# Altium schematic sheet Modulebit_004.SchDoc
size A2; Author: Steve Wiseman; Organization: Arbury.com Ltd; Address1: 2 Durnford Way; Address2: Cambridge; Address3: CB4 2DP; Address4: Unted Kingdom; DocumentNumber: 1; SheetNumber: 1; SheetTotal: 1
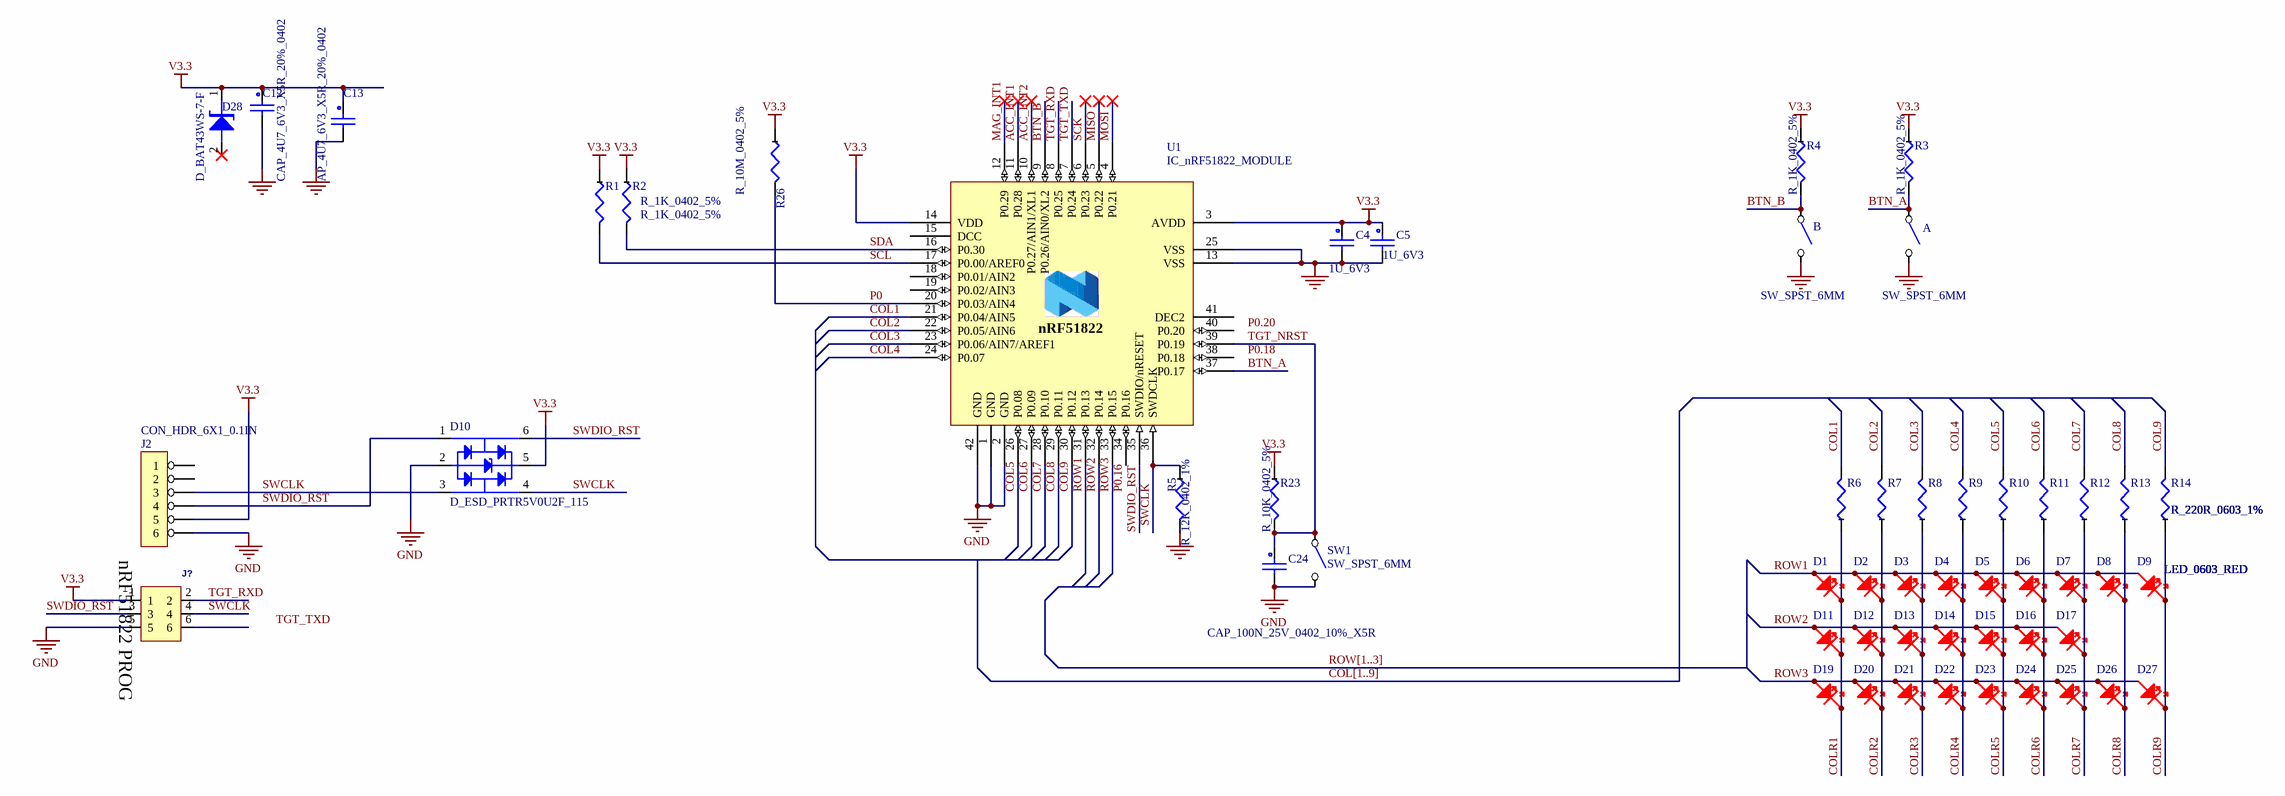
[diagram p0: Modulebit_004.SchDoc]

## Parts
A  SW_SPST_6MM  [SW_FSM4JSMA]
B  SW_SPST_6MM  [SW_FSM4JSMA]
C4  1U_6V3  [C_0402]
C5  1U_6V3  [C_0402]
C12  CAP_4U7_6V3_X5R_20%_0402  [c_0402]
C13  AP_4U7_6V3_X5R_20%_0402  [c_0402]
C24  CAP_100N_25V_0402_10%_X5R  [C_0402]
D1  LED_0603_RED  [LED_0603_RED]
D2  LED_0603_RED  [LED_0603_RED]
D3  LED_0603_RED  [LED_0603_RED]
D4  LED_0603_RED  [LED_0603_RED]
D5  LED_0603_RED  [LED_0603_RED]
D6  LED_0603_RED  [LED_0603_RED]
D7  LED_0603_RED  [LED_0603_RED]
D8  LED_0603_RED  [LED_0603_RED]
D9  LED_0603_RED  [LED_0603_RED]
D10  D_ESD_PRTR5V0U2F_115  [SOT886]
D11  LED_0603_RED  [LED_0603_RED]
D12  LED_0603_RED  [LED_0603_RED]
D13  LED_0603_RED  [LED_0603_RED]
D14  LED_0603_RED  [LED_0603_RED]
D15  LED_0603_RED  [LED_0603_RED]
D16  LED_0603_RED  [LED_0603_RED]
D17  LED_0603_RED  [LED_0603_RED]
D19  LED_0603_RED  [LED_0603_RED]
D20  LED_0603_RED  [LED_0603_RED]
D21  LED_0603_RED  [LED_0603_RED]
D22  LED_0603_RED  [LED_0603_RED]
D23  LED_0603_RED  [LED_0603_RED]
D24  LED_0603_RED  [LED_0603_RED]
D25  LED_0603_RED  [LED_0603_RED]
D26  LED_0603_RED  [LED_0603_RED]
D27  LED_0603_RED  [LED_0603_RED]
D28  D_BAT43WS-7-F  [SOD323]
J2  CON_HDR_6X1_0.1IN  [CON_HDR_6X1]
J?  Sockets & Adapters J-Link 6-pin Needle Adapter   Source:  Datasheet  [J-Link 6-pin Needle Adapter with legs]  (value not drawn)
R1  R_1K_0402_5%  [R_0402]
R2  R_1K_0402_5%  [R_0402]
R3  R_1K_0402_5%  [R_0402]
R4  R_1K_0402_5%  [R_0402]
R5  R_12K_0402_1%  [R_0402]
R6  R_220R_0603_1%  [R_0603]
R7  R_220R_0603_1%  [R_0603]
R8  R_220R_0603_1%  [R_0603]
R9  R_220R_0603_1%  [R_0603]
R10  R_220R_0603_1%  [R_0603]
R11  R_220R_0603_1%  [R_0603]
R12  R_220R_0603_1%  [R_0603]
R13  R_220R_0603_1%  [R_0603]
R14  R_220R_0603_1%  [R_0603]
R23  R_10K_0402_5%  [R_0402]
R26  R_10M_0402_5%  [R_0402]
SW1  SW_SPST_6MM  [SW_FSM4JSMA]
U1  IC_nRF51822_MODULE  [IC_nRF51822_MODULE_PASTE]

## Nets
GND: A.2 B.2 C4.2 C5.2 C12.2 C13.2 C24.2 D10.2 J2.6 J?.5 R5.2 SW1.2 U1.1(GND) U1.2(GND) U1.13(VSS) U1.25(VSS) U1.42(GND)
V3.3: C4.1 C5.1 C12.1 C13.1 D10.5 D28.1(K) J2.5 J?.1 R1.1 R2.1 R3.1 R4.1 R23.1 R26.1 U1.3(AVDD) U1.14(VDD)
ACC_INT1: U1.11(P0.28)
ACC_INT2: U1.10(P0.27/AIN1/XL1)
BTN_A: A.1 R3.2 U1.37(P0.17)
BTN_B: B.1 R4.2 U1.9(P0.26/AIN0/XL2)
COL1: R6.2 U1.21(P0.04/AIN5)
COL2: R7.2 U1.22(P0.05/AIN6)
COL3: R8.2 U1.23(P0.06/AIN7/AREF1)
COL4: R9.2 U1.24(P0.07)
COL5: R10.2 U1.26(P0.08)
COL6: R11.2 U1.27(P0.09)
COL7: R12.2 U1.28(P0.10)
COL8: R13.2 U1.29(P0.11)
COL9: R14.2 U1.30(P0.12)
COLR1: D1.K D11.K D19.K R6.1
COLR2: D2.K D12.K D20.K R7.1
COLR3: D3.K D13.K D21.K R8.1
COLR4: D4.K D14.K D22.K R9.1
COLR5: D5.K D15.K D23.K R10.1
COLR6: D6.K D16.K D24.K R11.1
COLR7: D7.K D17.K D25.K R12.1
COLR8: D8.K D26.K R13.1
COLR9: D9.K D27.K R14.1
MAG_INT1: U1.12(P0.29)
MISO: U1.5(P0.22)
MOSI: U1.4(P0.21)
P0: R26.2 U1.20(P0.03/AIN4)
ROW1: D1.A D2.A D3.A D4.A D5.A D6.A D7.A D8.A D9.A U1.31(P0.13)
ROW2: D11.A D12.A D13.A D14.A D15.A D16.A D17.A U1.32(P0.14)
ROW3: D19.A D20.A D21.A D22.A D23.A D24.A D25.A D26.A D27.A U1.33(P0.15)
SCK: U1.6(P0.23)
SCL: R1.2 U1.17(P0.00/AREF0)
SDA: R2.2 U1.16(P0.30)
SWCLK: D10.3 D10.4 J2.3 J?.4 R5.1 U1.36(SWDCLK)
SWDIO_RST: D10.1 D10.6 J2.4 J?.3 U1.35(SWDIO/nRESET)
TGT_NRST: C24.1 R23.2 SW1.1 U1.39(P0.19)
TGT_RXD: J?.2 U1.8(P0.25)
TGT_TXD: U1.7(P0.24)

Not connected (* = marked no-connect by the designer): D28 2(A)*; J2 1 2; J? 6; U1 15(DCC) 18(P0.01/AIN2) 19(P0.02/AIN3) 34(P0.16) 38(P0.18) 40(P0.20) 41(DEC2)

## Buses and harness runs
bus COL[1..9]
bus ROW[1..3]

## Notes on the sheet
- nRF51822 PROG
- Labels drawn without touching a wire or pin: P0.16, P0.18, P0.20, TGT_TXD
- Title
- Cambridge Prototypes Ltd
- Size:
- Date:
- File:
- A2
- Number:
- Time:
- Revision:
- Sheet
- of
- 2 Durnford Way
- Cambridge
- CB4 2DP
- (in symbol IC_nRF51822_MODULE) nRF51822

## Library data of the parts
A B SW1 = SW_SPST_6MM: SPST SWITCH 6MM; PART: FSM4JSMA; MANUFACTURER: TE CONNECTIVITY / ALCOSWITCH; FARNELL: 3801305
C4 C5 = CAP_1u_6V3_0402_10%_X6S: MANUFACTURER: YAGEO; PART: CC0402KRX7R7BB104; FARNELL: 9402047RL; MOUSER: 603-CC402KRX7R7BB104; DIGIKEY: 311-1338-6-ND
C12 C13 = CAP_4U7_6V3_X5R_20%_0402: PART: C1005X5R0J475M; MANUFACTURER: TDK; FARNELL: 1962109
C24 = CAP_100N_25V_0402_10%_X5R: PART: TMK105BJ104KV-F; MANUFACTURER: TAIYO YUDEN; FARNELL: 1611916
D1-D9 D11-D17 D19-D27 = LED_0603_RED: LED RED 0603; PART: KP-1608SURC; MANUFACTURER: KINGBRIGHT; FARNELL: 8529868RL
D10 = D_ESD_PRTR5V0U2F_115: Ultra low capacitance double rail-to-rail ESD protection; MANUFACTURER: NXP; FARNELL: 2459738; PART: PRTR5V0U2F_115
D28 = D_BAT43WS-7-F: Schottky 200mA 30V 0.5uA@25Vr; MANUFACTURER: Diodes Incorporated; RS: 751-3364P; FARNELL: 2305998; PART: BAT43WS-7-F; DIGIKEY: BAT43WS-FDICT-ND; MOUSER: 621-BAT43WS-F
J2 = CON_HDR_6X1_0.1IN: 6 PIN HEADER; MANUFACTURER: TE; PART: 826629-6; FARNELL: 3418327
J? = J-Link Connector: Manufacturer_Name: Segger Microcontroller; GateName_1: G$1; SymbolName_1: 8.06.16; LibraryName: 8.06.16; DeviceSetName: 8.06.16; Package: 80616; Manufacturer_Part_Number: 8.06.16; Mouser_Part_Number: 943-8.06.16; Mouser_Price-Stock: https://www.mouser.com/Search/Refine.aspx?Keyword=943-8.06.16; Height: 1mm
R6-R14 = R_220R_0603_1%: Text Field1: 9330801; Text Field2: vnr160; Text Field3: Yes; Text Field4: 502-468-00-00-RES*-BP; FARNELL_ROHS: *
R26 = R_10M_0402_5%: PART: RC0603FR-0710ML; MANUFACTURER: YAGEO; FARNELL: 9238964RL
U1 = IC_nRF51822_MODULE: RF System on a Chip - SoC 2.4GHz BT low Energy 256KB Flash 16KB Ram; MANUFACTURER: RAYTAC; PART: MDBT40-256V3; FARNELL: ???
R1-R4 = R_1K_0402_5%: FARNELL_ROHS: *; FARNELL: 1358043
R5 = R_12K_0402_1%: FARNELL_ROHS: 2447104RL; FARNELL: 2447104RL
R23 = R_10K_0402_5%: FARNELL_ROHS: *; FARNELL: 1358069